# EasyEDA schematic schematic_tab.json
TITLE: Sheet_1; REV: 1.0; Date: 2024-04-28; Sheet: 1/1; Drawn By: rjdoss; Company: Your Company
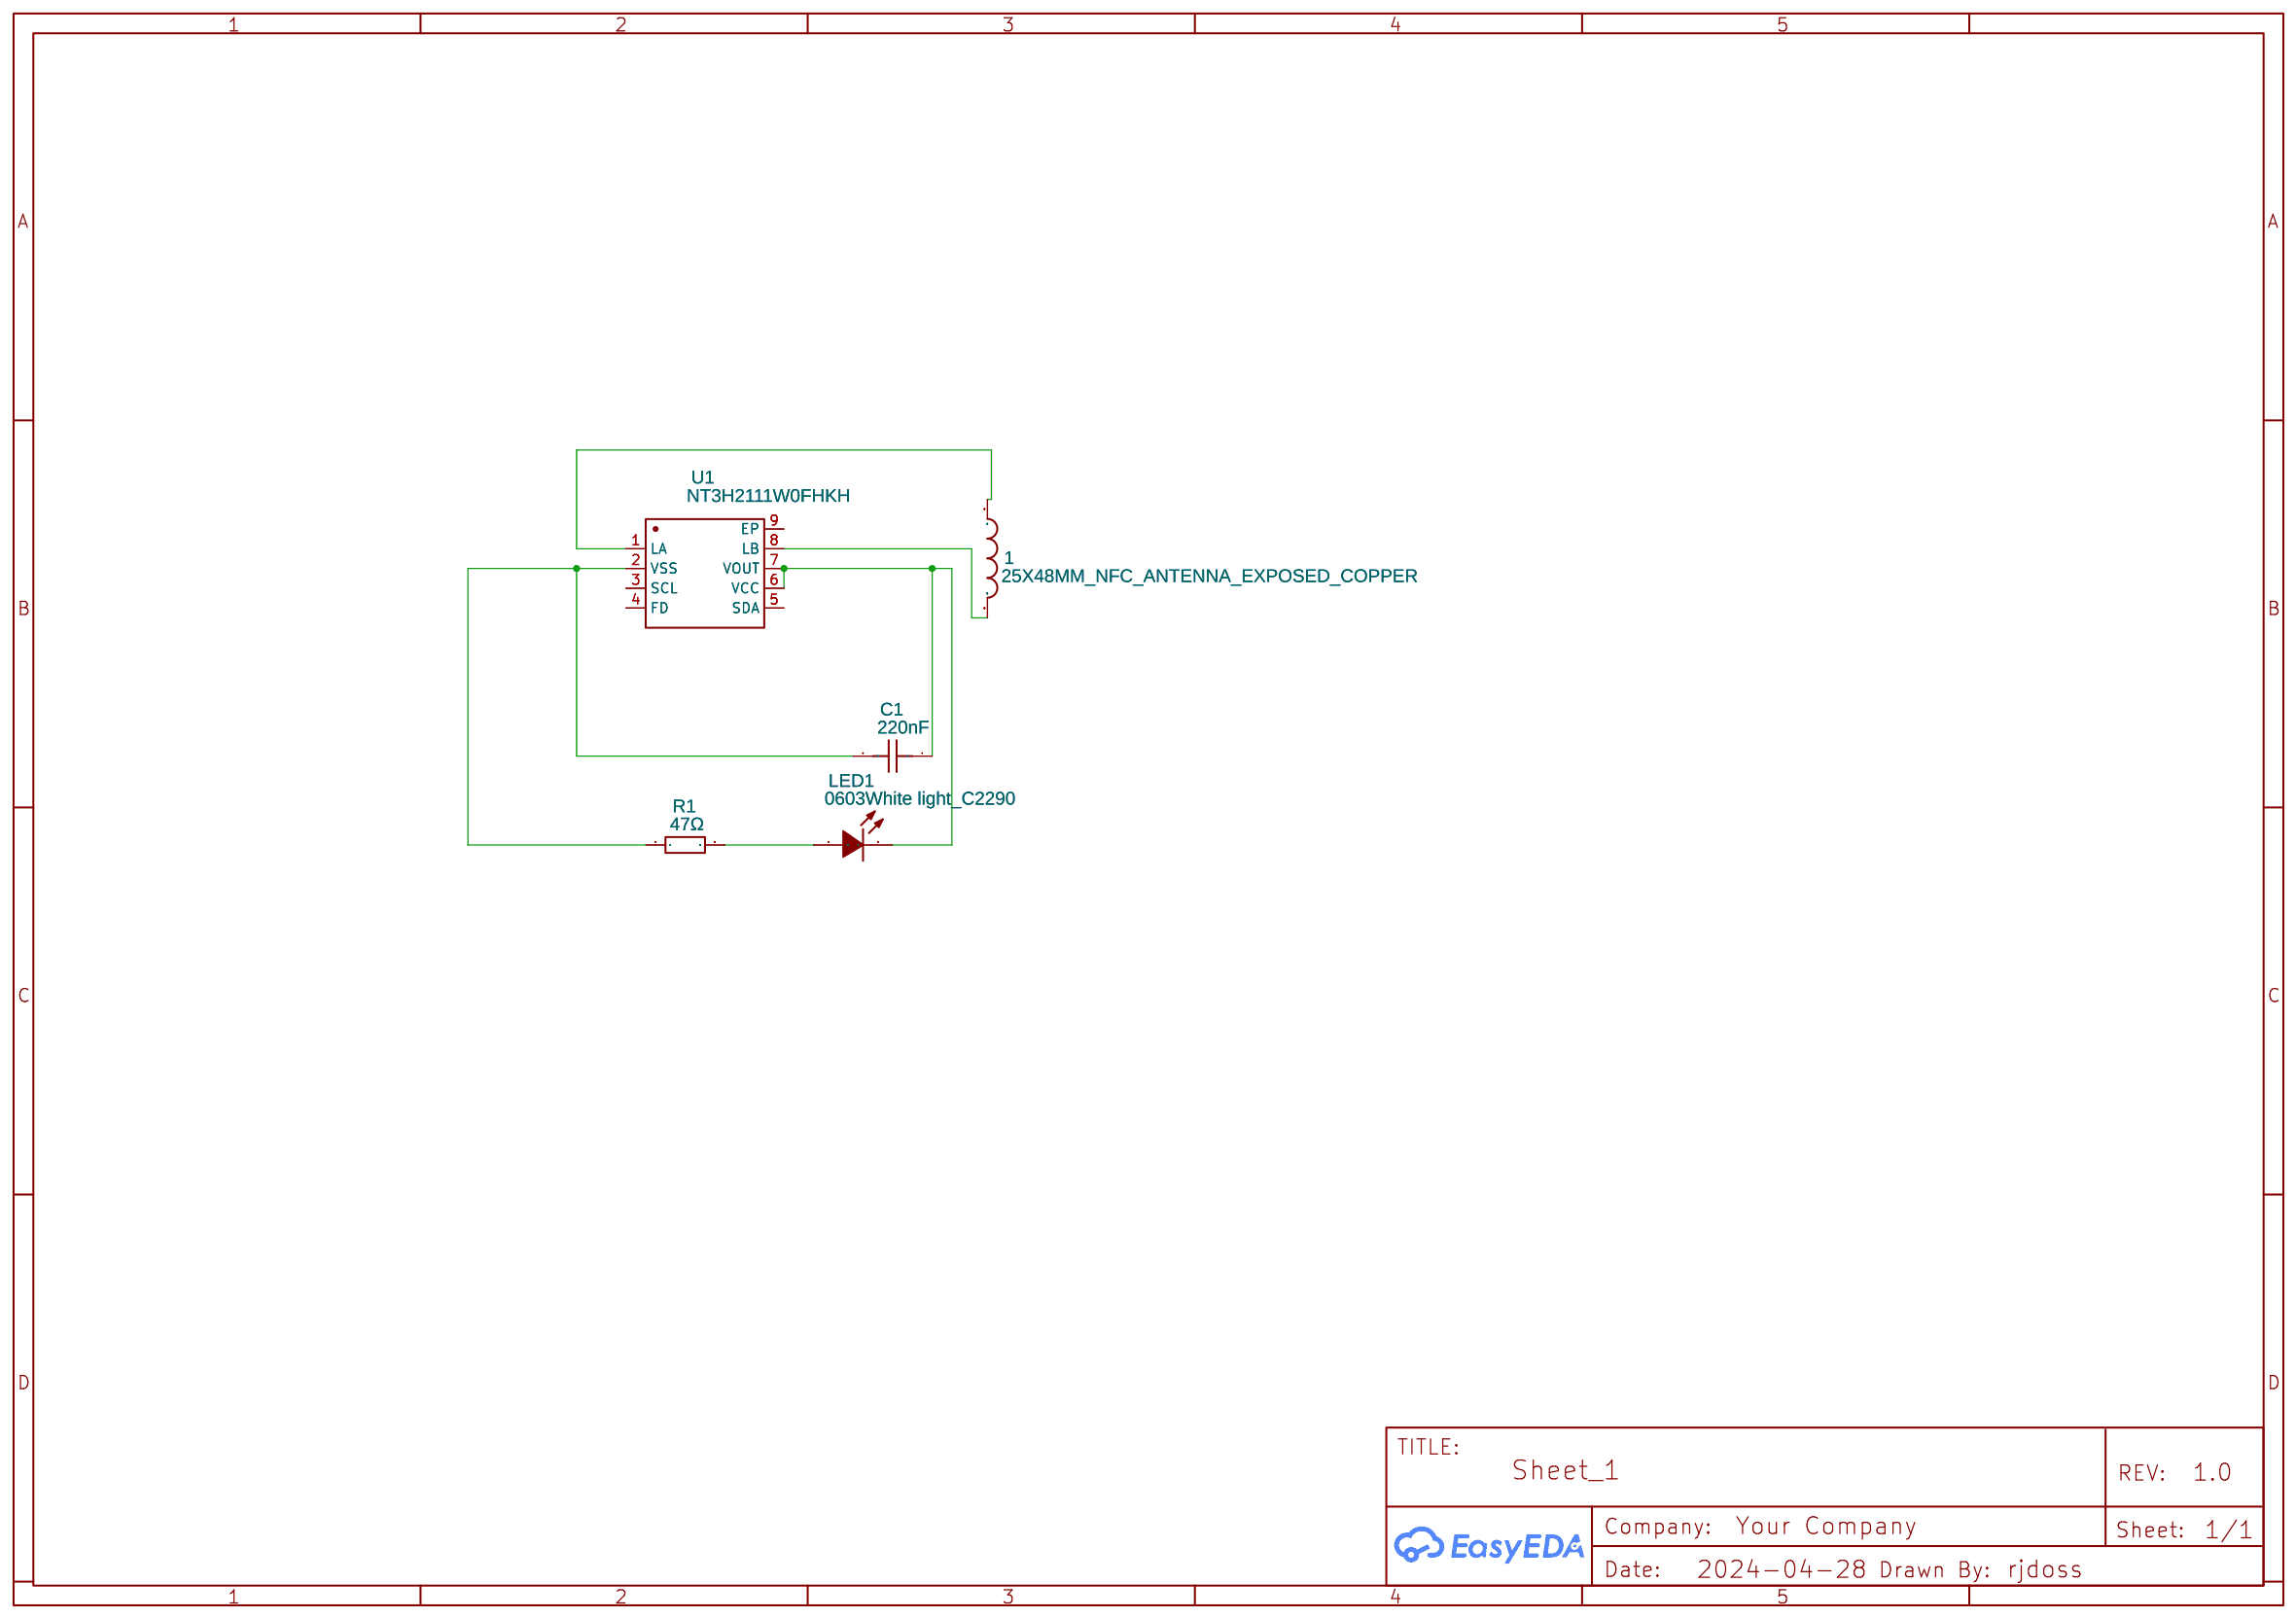
[diagram p0: schematic sheet]

## Parts
1  25X48MM_NFC_ANTENNA_EXPOSED_COPPER  [25X48MM_NFC_ANTENNA]
C1  220nF  [C0603]
LED1  0603White light_C2290  [LED0603-R-RD_WHITE]
R1  47Ω  [R0603]
U1  NT3H2111W0FHKH  [XQFN-8_L1.6-W1.6-P0.50-BL]

## Library data of the parts
1 = 25X48MM_NFC_ANTENNA_EXPOSED_COPPER: Contributor: bekirdurmaz2012
C1 = CL10F224ZA8NNNC: Contributor: LCSC; Supplier: LCSC; Manufacturer: SAMSUNG(三星); Supplier Part: C161186; JLCPCB Part Class: Extended Part
LED1 = 0603White light_C2290: Supplier: LCSC; Manufacturer: KENTO; Manufacturer Part: KT-0603白灯; Supplier Part: C2290; JLCPCB Part Class: Basic Part
R1 = 0603WAF470JT5E: Supplier: LCSC; Manufacturer: UNI-ROYAL(厚声); Supplier Part: C23182; JLCPCB Part Class: Basic Part
U1 = NT3H2111W0FHKH: Contributor: LCSC; Supplier: LCSC; Supplier Part: C710403; Manufacturer: NXP(恩智浦); JLCPCB Part Class: Extended Part

## Nets
Net-(1-P$1): 1.P$1 U1.1(LA)
Net-(1-P$2): 1.P$2 U1.8(LB)
Net-(C1-1): C1.1 LED1.2(K) U1.6(VCC) U1.7(VOUT)
Net-(C1-2): C1.2 R1.1 U1.2(VSS)
Net-(LED1-1): LED1.1(A) R1.2

Not connected (* = marked no-connect by the designer): U1 3(SCL) 4(FD) 5(SDA) 9(EP)
